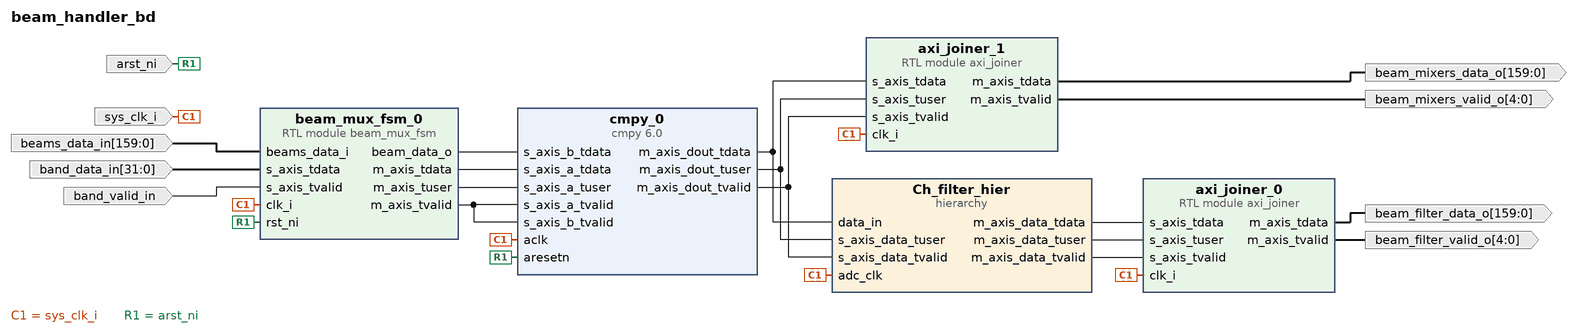
[diagram p0: block diagram of the top level]
# Vivado block design beam_handler_bd, xc7z030fbg676-2, Vivado 2024.2
create_bd_design beam_handler_bd

create_bd_port -dir I -type rst arst_ni
create_bd_port -dir I -from 31 -to 0 band_data_in
create_bd_port -dir I band_valid_in
create_bd_port -dir O -from 159 -to 0 beam_filter_data_o
create_bd_port -dir O -from 4 -to 0 beam_filter_valid_o
create_bd_port -dir O -from 159 -to 0 beam_mixers_data_o
create_bd_port -dir O -from 4 -to 0 beam_mixers_valid_o
create_bd_port -dir I -from 159 -to 0 beams_data_in
create_bd_port -dir I -type clk sys_clk_i
set_property -dict {CONFIG.FREQ_HZ 10000000} [get_bd_ports sys_clk_i]

create_bd_cell -type hier Ch_filter_hier
create_bd_cell -type module -reference axi_joiner axi_joiner_0
create_bd_cell -type module -reference axi_joiner axi_joiner_1
create_bd_cell -type module -reference beam_mux_fsm beam_mux_fsm_0
create_bd_cell -type ip -vlnv xilinx.com:ip:cmpy:6.0 cmpy_0
set_property -dict [list \
  CONFIG.ARESETN true \
  CONFIG.ATUSERWidth 3 \
  CONFIG.BTUSERWidth 1 \
  CONFIG.HasATUSER true \
  CONFIG.HasBTUSER false \
  CONFIG.MinimumLatency 6 \
  CONFIG.MultType Use_Mults \
  CONFIG.OutputWidth 16 \
] [get_bd_cells cmpy_0]

# ---- hierarchy /Ch_filter_hier ----
current_bd_instance /Ch_filter_hier
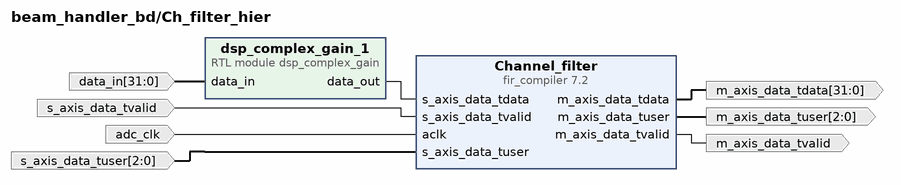
[diagram p1: block diagram inside /Ch_filter_hier]
create_bd_pin -dir I -type clk adc_clk
create_bd_pin -dir I -from 31 -to 0 data_in
create_bd_pin -dir O -from 31 -to 0 m_axis_data_tdata
create_bd_pin -dir O -from 2 -to 0 m_axis_data_tuser
create_bd_pin -dir O m_axis_data_tvalid
create_bd_pin -dir I -from 2 -to 0 s_axis_data_tuser
create_bd_pin -dir I s_axis_data_tvalid

create_bd_cell -type ip -vlnv xilinx.com:ip:fir_compiler:7.2 Channel_filter
set_property -dict [list \
  CONFIG.Clock_Frequency 260 \
  CONFIG.CoefficientSource COE_File \
  CONFIG.Coefficient_File ../../../../../../../filters/lowpass.coe \
  CONFIG.Coefficient_Fractional_Bits 20 \
  CONFIG.Coefficient_Reload false \
  CONFIG.Coefficient_Sets 1 \
  CONFIG.Coefficient_Sign Signed \
  CONFIG.Coefficient_Structure Inferred \
  CONFIG.Coefficient_Width 16 \
  CONFIG.ColumnConfig 1 \
  CONFIG.DATA_Has_TLAST Not_Required \
  CONFIG.Data_Fractional_Bits 0 \
  CONFIG.Data_Width 16 \
  CONFIG.Decimation_Rate 125 \
  CONFIG.Filter_Architecture Systolic_Multiply_Accumulate \
  CONFIG.Filter_Type Decimation \
  CONFIG.Interpolation_Rate 1 \
  CONFIG.M_DATA_Has_TUSER Chan_ID_Field \
  CONFIG.Number_Channels 5 \
  CONFIG.Number_Paths 2 \
  CONFIG.Output_Rounding_Mode Truncate_LSBs \
  CONFIG.Output_Width 16 \
  CONFIG.Quantization Quantize_Only \
  CONFIG.RateSpecification Frequency_Specification \
  CONFIG.S_DATA_Has_FIFO true \
  CONFIG.S_DATA_Has_TUSER Chan_ID_Field \
  CONFIG.Sample_Frequency 8.125 \
  CONFIG.Select_Pattern All \
  CONFIG.Zero_Pack_Factor 1 \
] [get_bd_cells Channel_filter]
create_bd_cell -type module -reference dsp_complex_gain dsp_complex_gain_1
set_property -dict {CONFIG.SHIFT_BY 2} [get_bd_cells dsp_complex_gain_1]

# ---- connections ----

current_bd_instance /Ch_filter_hier
connect_bd_net [get_bd_pins Channel_filter/m_axis_data_tdata] [get_bd_pins m_axis_data_tdata]
connect_bd_net [get_bd_pins Channel_filter/m_axis_data_tuser] [get_bd_pins m_axis_data_tuser]
connect_bd_net [get_bd_pins Channel_filter/m_axis_data_tvalid] [get_bd_pins m_axis_data_tvalid]
connect_bd_net -net Channel_mixer_m_axis_dout_tdata [get_bd_pins data_in] [get_bd_pins dsp_complex_gain_1/data_in]
connect_bd_net -net Channel_mixer_m_axis_dout_tvalid [get_bd_pins s_axis_data_tvalid] [get_bd_pins Channel_filter/s_axis_data_tvalid]
connect_bd_net -net aclk_0_1 [get_bd_pins adc_clk] [get_bd_pins Channel_filter/aclk]
connect_bd_net [get_bd_pins dsp_complex_gain_1/data_out] [get_bd_pins Channel_filter/s_axis_data_tdata]
connect_bd_net [get_bd_pins s_axis_data_tuser] [get_bd_pins Channel_filter/s_axis_data_tuser]

current_bd_instance /
connect_bd_net [get_bd_pins Ch_filter_hier/m_axis_data_tdata] [get_bd_pins axi_joiner_0/s_axis_tdata]
connect_bd_net [get_bd_pins Ch_filter_hier/m_axis_data_tuser] [get_bd_pins axi_joiner_0/s_axis_tuser]
connect_bd_net [get_bd_pins Ch_filter_hier/m_axis_data_tvalid] [get_bd_pins axi_joiner_0/s_axis_tvalid]
connect_bd_net -net aclk_0_1 [get_bd_ports sys_clk_i] \
  [get_bd_pins Ch_filter_hier/adc_clk] [get_bd_pins cmpy_0/aclk] [get_bd_pins axi_joiner_0/clk_i] \
  [get_bd_pins axi_joiner_1/clk_i] [get_bd_pins beam_mux_fsm_0/clk_i]
connect_bd_net -net aresetn_0_1 [get_bd_ports arst_ni] [get_bd_pins cmpy_0/aresetn] [get_bd_pins beam_mux_fsm_0/rst_ni]
connect_bd_net [get_bd_pins axi_joiner_0/m_axis_tdata] [get_bd_ports beam_filter_data_o]
connect_bd_net [get_bd_pins axi_joiner_0/m_axis_tvalid] [get_bd_ports beam_filter_valid_o]
connect_bd_net [get_bd_pins axi_joiner_1/m_axis_tdata] [get_bd_ports beam_mixers_data_o]
connect_bd_net [get_bd_pins axi_joiner_1/m_axis_tvalid] [get_bd_ports beam_mixers_valid_o]
connect_bd_net [get_bd_pins beam_mux_fsm_0/beam_data_o] [get_bd_pins cmpy_0/s_axis_b_tdata]
connect_bd_net [get_bd_pins beam_mux_fsm_0/m_axis_tdata] [get_bd_pins cmpy_0/s_axis_a_tdata]
connect_bd_net [get_bd_pins beam_mux_fsm_0/m_axis_tuser] [get_bd_pins cmpy_0/s_axis_a_tuser]
connect_bd_net [get_bd_pins beam_mux_fsm_0/m_axis_tvalid] [get_bd_pins cmpy_0/s_axis_a_tvalid] [get_bd_pins cmpy_0/s_axis_b_tvalid]
connect_bd_net -net beams_data_i_0_1 [get_bd_ports beams_data_in] [get_bd_pins beam_mux_fsm_0/beams_data_i]
connect_bd_net [get_bd_pins cmpy_0/m_axis_dout_tdata] [get_bd_pins Ch_filter_hier/data_in] [get_bd_pins axi_joiner_1/s_axis_tdata]
connect_bd_net [get_bd_pins cmpy_0/m_axis_dout_tuser] [get_bd_pins Ch_filter_hier/s_axis_data_tuser] [get_bd_pins axi_joiner_1/s_axis_tuser]
connect_bd_net [get_bd_pins cmpy_0/m_axis_dout_tvalid] [get_bd_pins Ch_filter_hier/s_axis_data_tvalid] [get_bd_pins axi_joiner_1/s_axis_tvalid]
connect_bd_net -net s_axis_tdata_0_1 [get_bd_ports band_data_in] [get_bd_pins beam_mux_fsm_0/s_axis_tdata]
connect_bd_net -net s_axis_tvalid_0_1 [get_bd_ports band_valid_in] [get_bd_pins beam_mux_fsm_0/s_axis_tvalid]

validate_bd_design
save_bd_design
